# Altium schematic sheet MCU.SchDoc
size A4
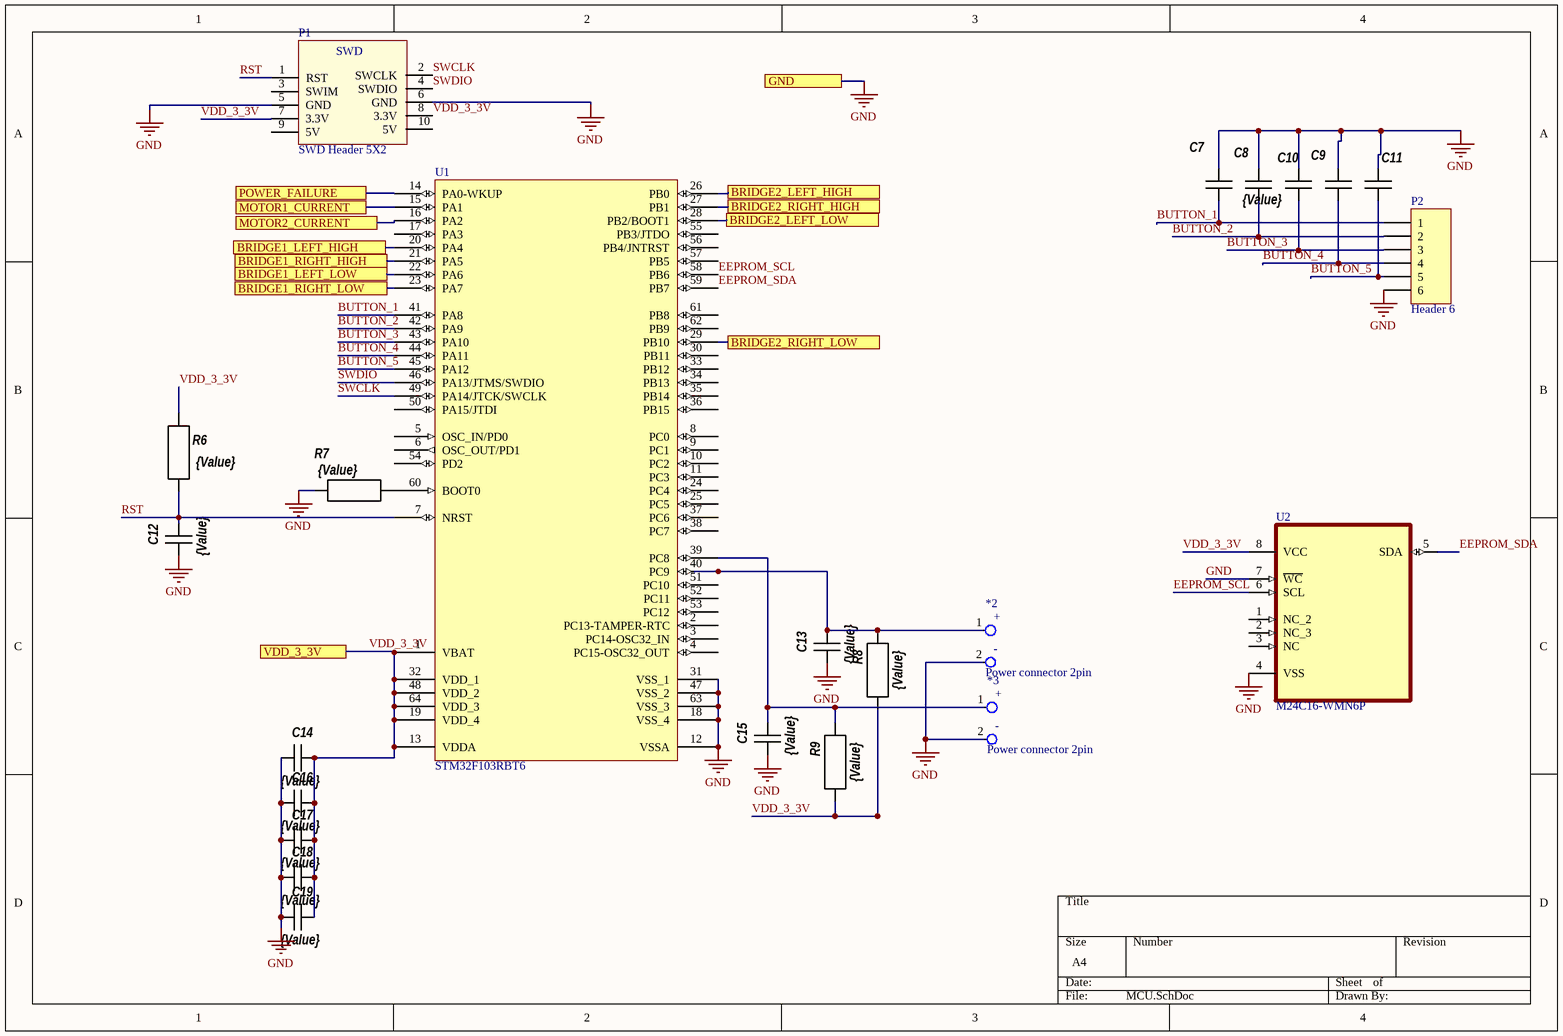
[diagram p0: MCU.SchDoc]

## Parts
*2  Power connector 2pin  [Power connector 2 pin]
*3  Power connector 2pin  [Power connector 2 pin]
C7  value {Value}  [R0805]  (hidden comment: Cap 0805)
C8  Cap 0805  [R0805]  (value not drawn)
C9  Cap 0805  [R0805]  (value not drawn)
C10  Cap 0805  [R0805]  (value not drawn)
C11  Cap 0805  [R0805]  (value not drawn)
C12  value {Value}  [R0805]  (hidden comment: Cap 0805)
C13  value {Value}  [R0805]  (hidden comment: Cap 0805)
C14  value {Value}  [R0805]  (hidden comment: Cap 0805)
C15  value {Value}  [R0805]  (hidden comment: Cap 0805)
C16  value {Value}  [R0805]  (hidden comment: Cap 0805)
C17  value {Value}  [R0805]  (hidden comment: Cap 0805)
C18  value {Value}  [R0805]  (hidden comment: Cap 0805)
C19  value {Value}  [R0805]  (hidden comment: Cap 0805)
P1  SWD Header 5X2  [HDR2X5]
P2  Header 6  [HDR1X6]
R6  value {Value}  [R0805]  (hidden comment: Res 0805)
R7  value {Value}  [R0805]  (hidden comment: Res 0805)
R8  value {Value}  [R0805]  (hidden comment: Res 0805)
R9  value {Value}  [R0805]  (hidden comment: Res 0805)
U1  STM32F103RBT6  [LQFP64_N]
U2  M24C16-WMN6P  [SOIC127P600X175-8N]

## Ports
BRIDGE1_LEFT_HIGH, BRIDGE1_LEFT_LOW, BRIDGE1_RIGHT_HIGH, BRIDGE1_RIGHT_LOW, BRIDGE2_LEFT_HIGH, BRIDGE2_LEFT_LOW, BRIDGE2_RIGHT_HIGH, BRIDGE2_RIGHT_LOW, GND, MOTOR1_CURRENT, MOTOR2_CURRENT, POWER_FAILURE, VDD_3_3V

## Nets
GND: *2.2 *3.2 C7.2 C8.2 C9.2 C10.2 C11.2 C12.1 C13.1 C14.1 C15.1 C16.1 C17.1 C18.1 C19.1 P1.5(GND) P1.6(GND) P2.6 R7.1 U1.12(VSSA) U1.18(VSS_4) U1.31(VSS_1) U1.47(VSS_2) U1.63(VSS_3) U2.4(VSS) U2.7(~{WC}) ; port GND
BRIDGE1_LEFT_HIGH: U1.20(PA4) ; port BRIDGE1_LEFT_HIGH
BRIDGE1_LEFT_LOW: U1.22(PA6) ; port BRIDGE1_LEFT_LOW
BRIDGE1_RIGHT_HIGH: U1.21(PA5) ; port BRIDGE1_RIGHT_HIGH
BRIDGE1_RIGHT_LOW: U1.23(PA7) ; port BRIDGE1_RIGHT_LOW
BRIDGE2_LEFT_HIGH: U1.26(PB0) ; port BRIDGE2_LEFT_HIGH
BRIDGE2_LEFT_LOW: U1.28(PB2/BOOT1) ; port BRIDGE2_LEFT_LOW
BRIDGE2_RIGHT_HIGH: U1.27(PB1) ; port BRIDGE2_RIGHT_HIGH
BRIDGE2_RIGHT_LOW: U1.29(PB10) ; port BRIDGE2_RIGHT_LOW
BUTTON_1: C7.1 P2.1 U1.41(PA8)
BUTTON_2: C8.1 P2.2 U1.42(PA9)
BUTTON_3: C10.1 P2.3 U1.43(PA10)
BUTTON_4: C9.1 P2.4 U1.44(PA11)
BUTTON_5: C11.1 P2.5 U1.45(PA12)
EEPROM_SCL: U1.58(PB6) U2.6(SCL)
EEPROM_SDA: U1.59(PB7) U2.5(SDA)
MOTOR1_CURRENT: U1.15(PA1) ; port MOTOR1_CURRENT
MOTOR2_CURRENT: U1.16(PA2) ; port MOTOR2_CURRENT
POWER_FAILURE: U1.14(PA0-WKUP) ; port POWER_FAILURE
RST: C12.2 P1.1(RST) R6.1 U1.7(NRST)
SWCLK: P1.2(SWCLK) U1.49(PA14/JTCK/SWCLK)
SWDIO: P1.4(SWDIO) U1.46(PA13/JTMS/SWDIO)
VDD_3_3V: C14.2 C16.2 C17.2 C18.2 C19.2 P1.7(3.3V) P1.8(3.3V) R6.2 R8.1 R9.1 U1.1(VBAT) U1.13(VDDA) U1.19(VDD_4) U1.32(VDD_1) U1.48(VDD_2) U1.64(VDD_3) U2.8(VCC) ; port VDD_3_3V
Net*2_1: *2.1 C13.2 R8.2 U1.40(PC9)
Net*3_1: *3.1 C15.2 R9.2 U1.39(PC8)
NetR7_2: R7.2 U1.60(BOOT0)

Not connected (* = marked no-connect by the designer): P1 3(SWIM) 9(5V) 10(5V); U1 2(PC13-TAMPER-RTC) 3(PC14-OSC32_IN) 4(PC15-OSC32_OUT) 5(OSC_IN/PD0) 6(OSC_OUT/PD1) 8(PC0) 9(PC1) 10(PC2) 11(PC3) 17(PA3) 24(PC4) 25(PC5) 30(PB11) 33(PB12) 34(PB13) 35(PB14) 36(PB15) 37(PC6) 38(PC7) 50(PA15/JTDI) 51(PC10) 52(PC11) 53(PC12) 54(PD2) 55(PB3/JTDO) 56(PB4/JNTRST) 57(PB5) 61(PB8) 62(PB9); U2 1(NC_2) 2(NC_3) 3(NC)

## Notes on the sheet
- (in symbol Power connector 2pin) +; -
- (in symbol SWD Header 5X2) SWD

## Library data of the parts
C7-C19 = Cap 0805: Конденсатор 0805; Manufacturer: Murata; sm_pins: 2; th_pins: 0; Model: 0805
P1 = SWD Header 5X2: Header, 5-Pin, Dual row; LatestRevisionDate: 17-Jul-2002; LatestRevisionNote: Re-released for DXP Platform.; Publisher: Altium Limited
P2 = Header 6: Header, 6-Pin; LatestRevisionDate: 17-Jul-2002; LatestRevisionNote: Re-released for DXP Platform.; Publisher: Altium Limited
R6-R9 = Res 0805: Резистор 0805; Manufacturer: Yageo; sm_pins: 2; th_pins: 0; Model: *
U1 = STM32F103RBT6: STM32 ARM-based 32-bit MCU with 128 Kbytes Flash, 64-pin LQFP, Industrial Temperature; Published: 30-May-2008; DatasheetVersion: rev6, Mar-2008; PackageVersion: Mar-2008; PackageReference: LQFP64; Publisher: Altium Limited; PackageDescription: 64-Pin Low-Profile Quad Flat Pack, 10 x 10 mm Body, 0.5 mm Pitch (LQFP64); ComponentLink1Description: Manufacturer Link; ComponentLink1URL: www.st.com/stm32; ComponentLink2Description: Datasheet; ComponentLink2URL: http://www.st.com/stonline/products/literature/ds/13587.pdf
U2 = M24C16-WMN6P: EEPROM Memory IC 16Kb _2K x 8_ IÂ²C 400kHz 900ns 8-SO; MF: STMicroelectronics; Package: SO-8 STMicroelectronics; Availability: Unavailable; Value: *; MP: M24C16-WMN6P; SnapEDA_Link: https://www.snapeda.com/parts/M24C16-WMN6P/STMicroelectronics/view-part/42148/?ref=snap; Price: None